# EAGLE schematic RP2040_MainV1_alternateLayout (EAGLE 9.6.2)

## Sheet 1 of 3
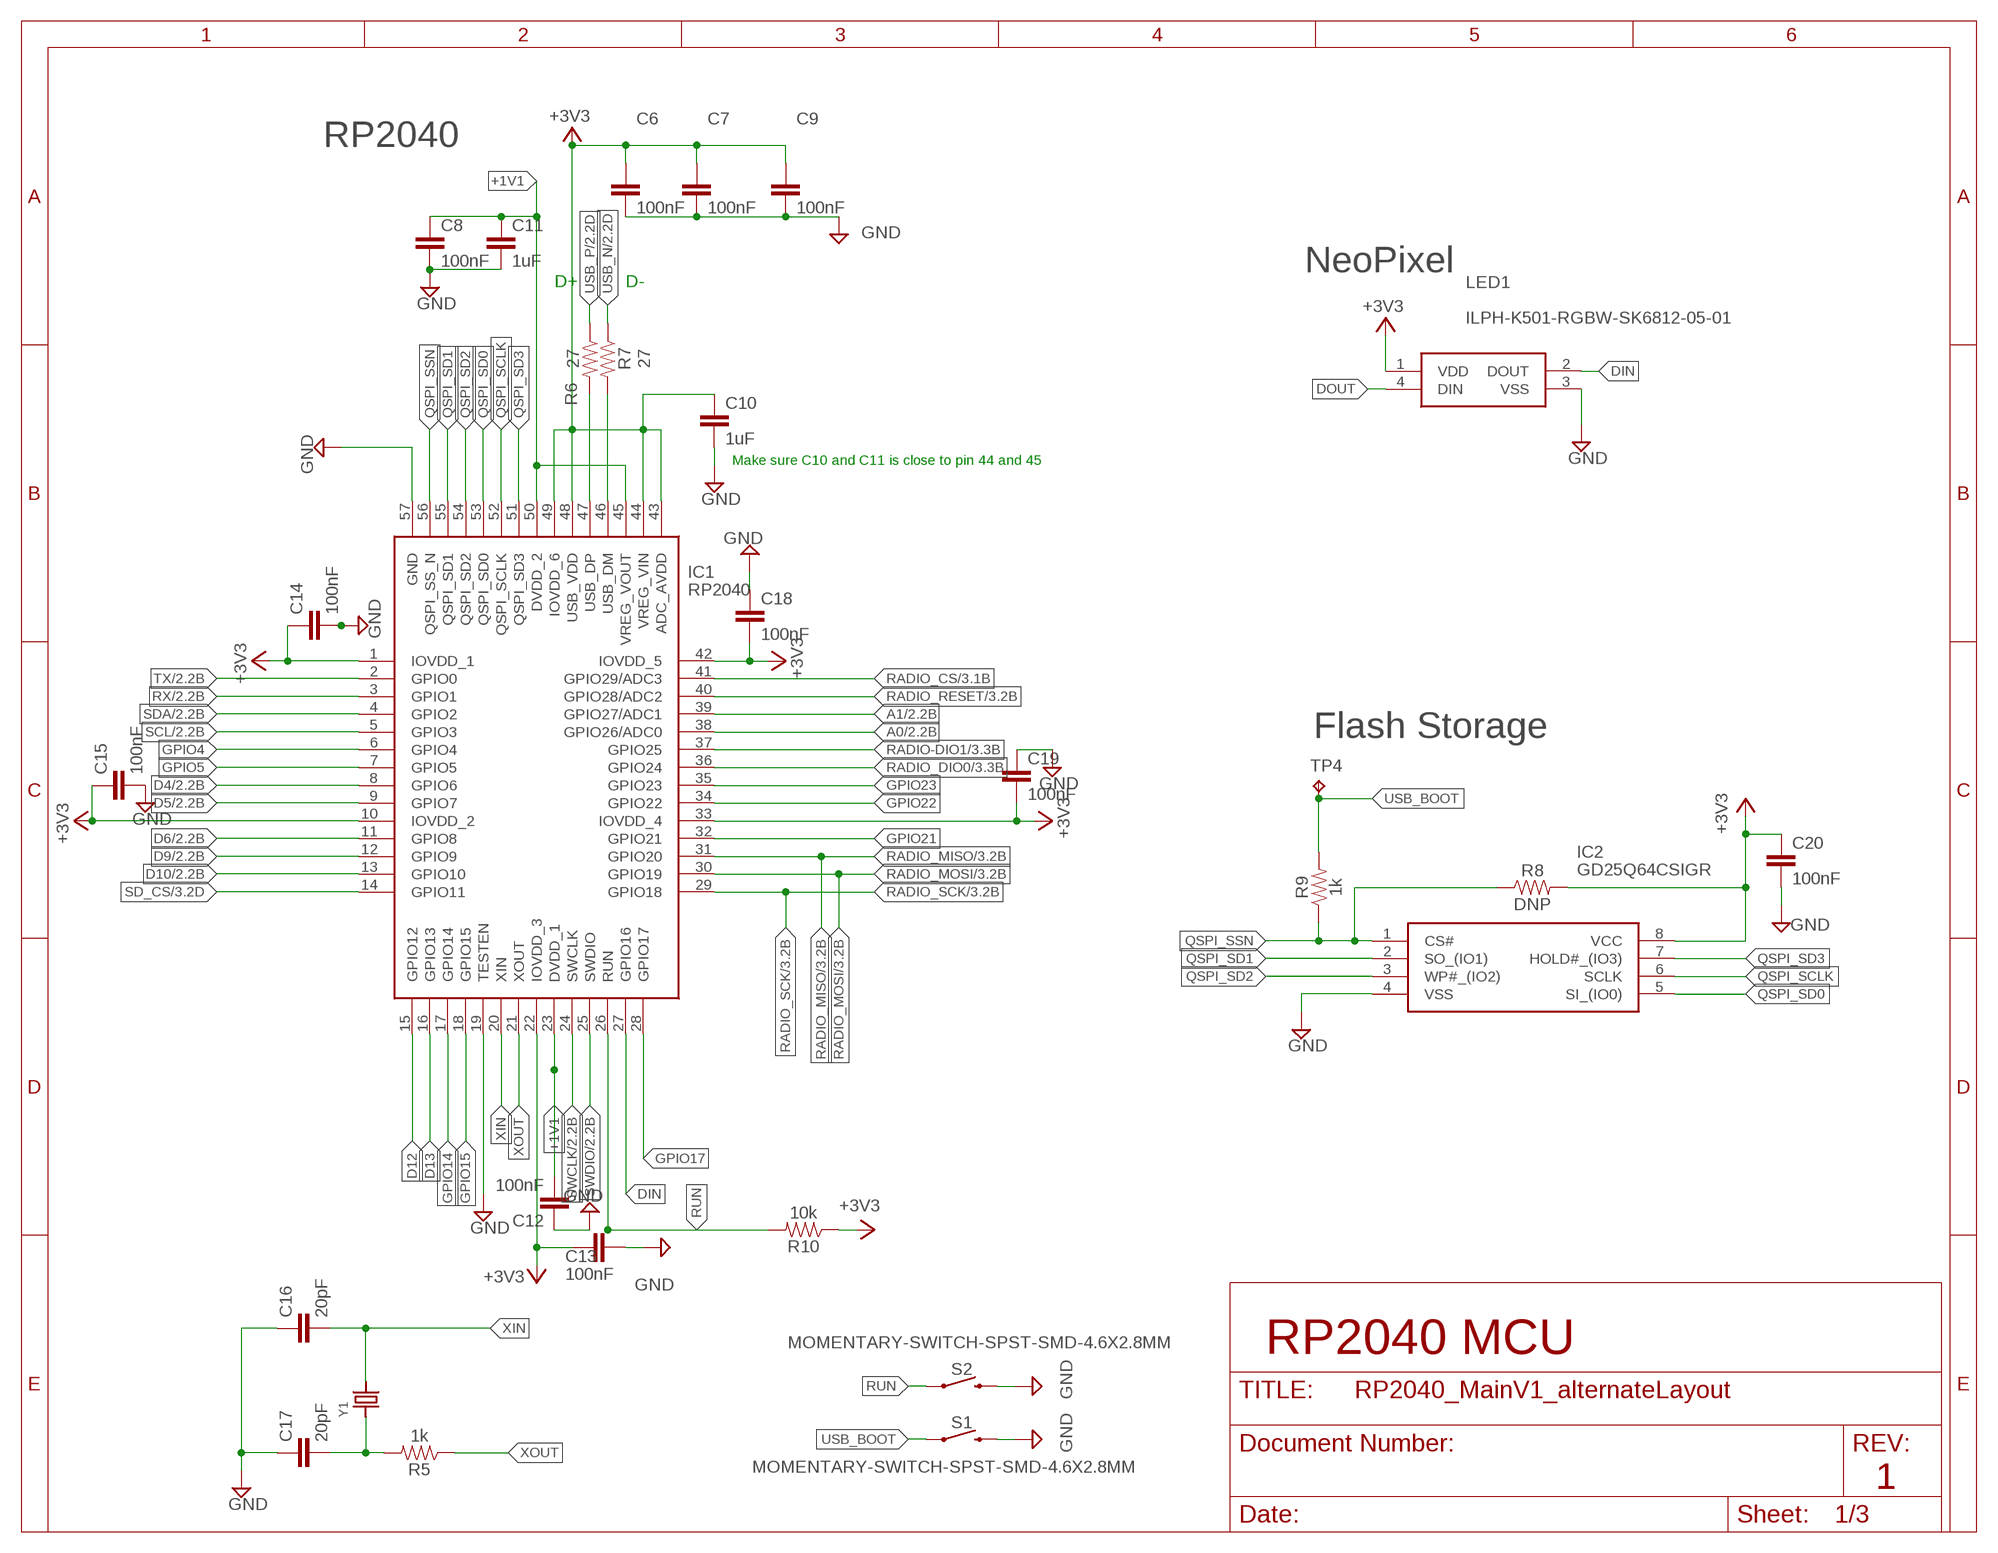
[diagram p0: schematic, sheet 1]

### Parts
C6  100nF  0.1UF-0402-10V-10%-X7R  [0402]
C7  100nF  0.1UF-0402-10V-10%-X7R  [0402]
C8  100nF  0.1UF-0402-10V-10%-X7R  [0402]
C9  100nF  0.1UF-0402-10V-10%-X7R  [0402]
C10  1uF  0.1UF-0402-10V-10%-X7R  [0402]
C11  1uF  0.1UF-0402-10V-10%-X7R  [0402]
C12  100nF  0.1UF-0402-10V-10%-X7R  [0402]
C13  100nF  0.1UF-0402-10V-10%-X7R  [0402]
C14  100nF  0.1UF-0402-10V-10%-X7R  [0402]
C15  100nF  0.1UF-0402-10V-10%-X7R  [0402]
C16  20pF  10NF-0603-50V-10%  [0603]
C17  20pF  10NF-0603-50V-10%  [0603]
C18  100nF  0.1UF-0402-10V-10%-X7R  [0402]
C19  100nF  0.1UF-0402-10V-10%-X7R  [0402]
C20  100nF  0.1UF-0603-25V-(+80/-20%)  [0603]
IC1  RP2040  [QFN40P700X700X90-57N]
IC2  GD25Q64CSIGR  [SOIC127P790X216-8N]
LED1  ILPH-K501-RGBW-SK6812-05-01  [ILPHK501RGBWSK68120501]
R5  1k  0.05OHM-0603-1/5W-1%  [0603]
R6  27  0.05OHM-0603-1/5W-1%  [0603]
R7  27  0.05OHM-0603-1/5W-1%  [0603]
R8  DNP  0.05OHM-0603-1/5W-1%  [0603]
R9  1k  0.05OHM-0603-1/5W-1%  [0603]
R10  10k  0.05OHM-0603-1/5W-1%  [0603]
S1  MOMENTARY-SWITCH-SPST-SMD-4.6X2.8MM  [TACTILE_SWITCH_SMD_4.6X2.8MM]
S2  MOMENTARY-SWITCH-SPST-SMD-4.6X2.8MM  [TACTILE_SWITCH_SMD_4.6X2.8MM]
TP4  TPTP12R  [TP12R]
Y1  CRYSTAL2.5X2.0MM  [CRYSTAL_2.5X2]

### Nets
+1V1: C8.1 C11.1 C12.2 IC1.23(DVDD_1) IC1.45(VREG_VOUT) IC1.50(DVDD_2)
+3V3: C6.1 C7.1 C9.1 C10.1 C13.2 C14.1 C15.1 C18.2 C19.2 C20.1 IC1.1(IOVDD_1) IC1.10(IOVDD_2) IC1.22(IOVDD_3) IC1.33(IOVDD_4) IC1.42(IOVDD_5) IC1.43(ADC_AVDD) IC1.44(VREG_VIN) IC1.48(USB_VDD) IC1.49(IOVDD_6) IC2.8(VCC) LED1.1(VDD) R8.2 R10.1 ; also sheet 2,3
A0: IC1.38(GPIO26/ADC0) ; also sheet 2
A1: IC1.39(GPIO27/ADC1) ; also sheet 2
D4: IC1.8(GPIO6) ; also sheet 2
D5: IC1.9(GPIO7) ; also sheet 2
D6: IC1.11(GPIO8) ; also sheet 2
D9: IC1.12(GPIO9) ; also sheet 2
D10: IC1.13(GPIO10) ; also sheet 2
D12: IC1.15(GPIO12)
D13: IC1.16(GPIO13)
DIN: IC1.27(GPIO16) LED1.2(DOUT)
DOUT: LED1.4(DIN)
GND: C6.2 C7.2 C8.2 C9.2 C10.2 C11.2 C12.1 C13.1 C14.2 C15.2 C16.1 C17.1 C18.1 C19.1 C20.2 IC1.19(TESTEN) IC1.57(GND) IC2.4(VSS) LED1.3(VSS) S1.3 S1.4 S2.3 S2.4 ; also sheet 2,3
GPIO4: IC1.6(GPIO4)
GPIO5: IC1.7(GPIO5)
GPIO14: IC1.17(GPIO14)
GPIO15: IC1.18(GPIO15)
GPIO17: IC1.28(GPIO17)
GPIO21: IC1.32(GPIO21)
GPIO22: IC1.34(GPIO22)
GPIO23: IC1.35(GPIO23)
N$1: C17.2 R5.2 Y1.1
QSPI_SCLK: IC1.52(QSPI_SCLK) IC2.6(SCLK)
QSPI_SD0: IC1.53(QSPI_SD0) IC2.5(SI_(IO0))
QSPI_SD1: IC1.55(QSPI_SD1) IC2.2(SO_(IO1))
QSPI_SD2: IC1.54(QSPI_SD2) IC2.3(WP#_(IO2))
QSPI_SD3: IC1.51(QSPI_SD3) IC2.7(HOLD#_(IO3))
QSPI_SSN: IC1.56(QSPI_SS_N) IC2.1(CS#) R8.1 R9.1
RADIO-DIO1: IC1.37(GPIO25) ; also sheet 3
RADIO_CS: IC1.41(GPIO29/ADC3) ; also sheet 3
RADIO_DIO0: IC1.36(GPIO24) ; also sheet 3
RADIO_MISO: IC1.31(GPIO20) ; also sheet 3
RADIO_MOSI: IC1.30(GPIO19) ; also sheet 3
RADIO_RESET: IC1.40(GPIO28/ADC2) ; also sheet 3
RADIO_SCK: IC1.29(GPIO18) ; also sheet 3
RUN: IC1.26(RUN) R10.2 S2.1 S2.2
RX: IC1.3(GPIO1) ; also sheet 2
SCL: IC1.5(GPIO3) ; also sheet 2
SD_CS: IC1.14(GPIO11) ; also sheet 3
SDA: IC1.4(GPIO2) ; also sheet 2
SWCLK: IC1.24(SWCLK) ; also sheet 2
SWDIO: IC1.25(SWDIO) ; also sheet 2
TX: IC1.2(GPIO0) ; also sheet 2
USB_BOOT: R9.2 S1.1 S1.2 TP4.TP
USB_DM\: IC1.46(USB_DM) R7.2
USB_DP: IC1.47(USB_DP) R6.2
USB_N: R7.1 ; also sheet 2
USB_P: R6.1 ; also sheet 2
XIN: C16.2 IC1.20(XIN) Y1.3
XOUT: IC1.21(XOUT) R5.1

### Notes on the sheet
- RP2040
- NeoPixel
- D+ | D-
- Make sure C10 and C11 is close to pin 44 and 45
- Flash Storage
- RP2040 MCU
- 1

## Sheet 2 of 3
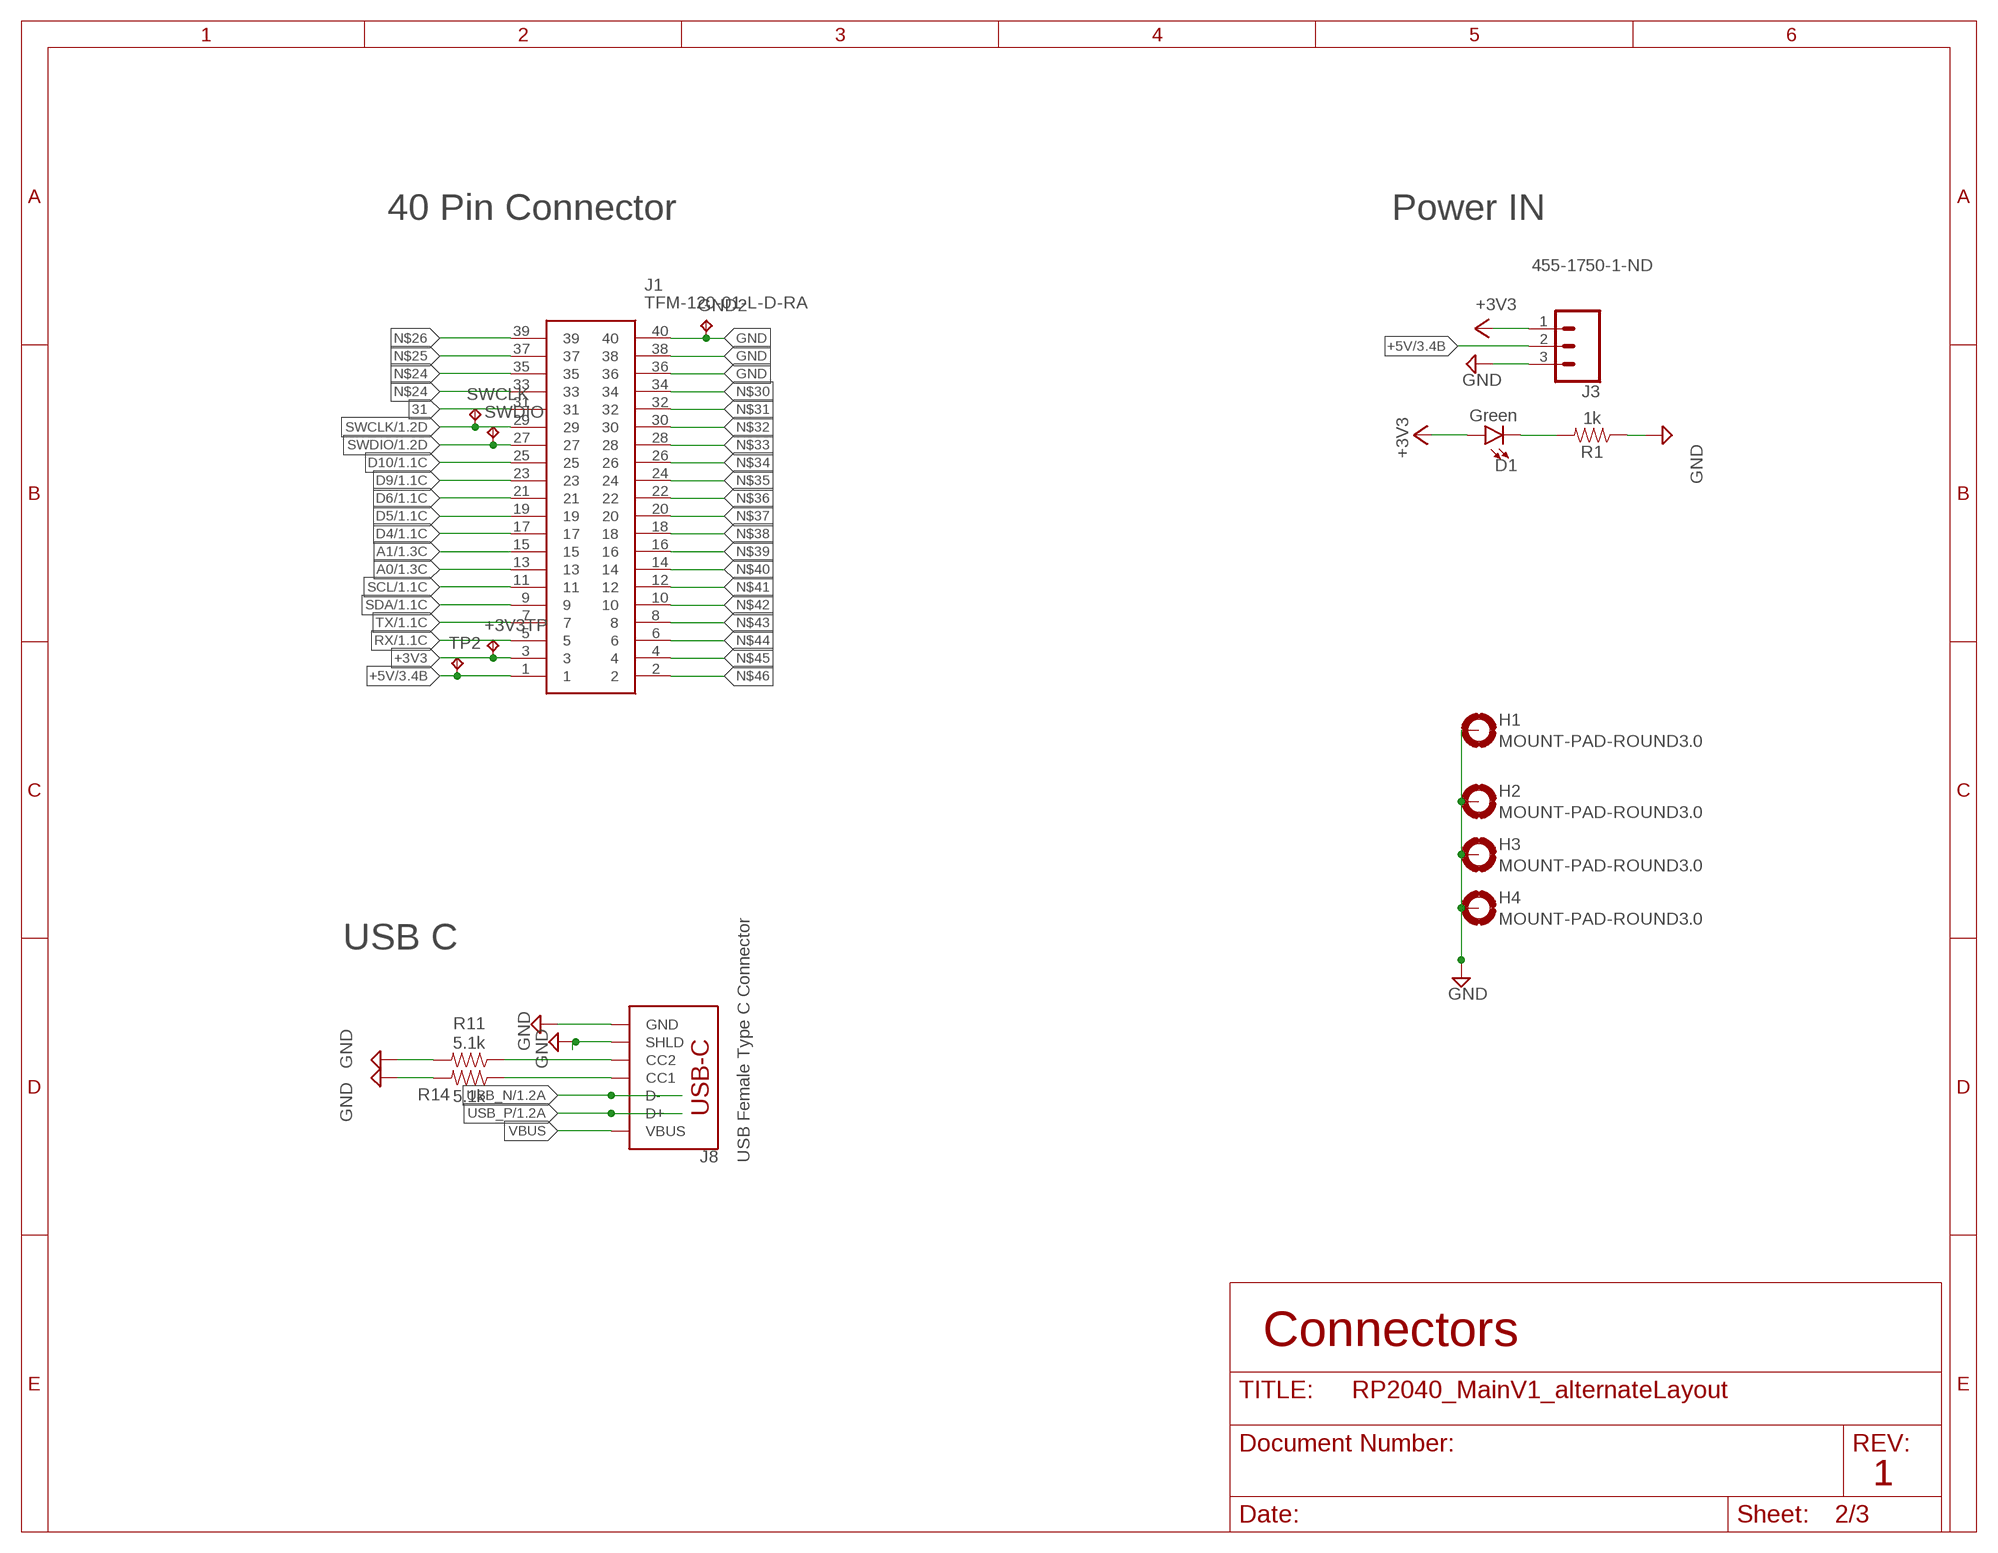
[diagram p1: schematic, sheet 2]

### Parts
+3V3TP  TPTP12R  [TP12R]
D1  Green  LED-GREEN-0603-WE  [LED-0603]
GND2  TPTP12R  [TP12R]
H1  MOUNT-PAD-ROUND3.0  [3,0-PAD]
H2  MOUNT-PAD-ROUND3.0  [3,0-PAD]
H3  MOUNT-PAD-ROUND3.0  [3,0-PAD]
H4  MOUNT-PAD-ROUND3.0  [3,0-PAD]
J1  TFM-120-01-L-D-RA  [TFM-120-01-XXX-D-RA]
J3  455-1750-1-ND  CONN_03  [1X03]
J8  USB Female Type C Connector  USB_C_4-LAYER-ISOLATED  [USB-C-16P-4LAYER-ISOLATED]
R1  1k  0.05OHM-0603-1/5W-1%  [0603]
R11  5.1k  0.05OHM-0603-1/5W-1%  [0603]
R14  5.1k  0.05OHM-0603-1/5W-1%  [0603]
SWCLK  TPTP12R  [TP12R]
SWDIO  TPTP12R  [TP12R]
TP2  TPTP12R  [TP12R]

### Nets
31: J1.31
+3V3: +3V3TP.TP D1.A J1.3 J3.1 ; also sheet 1,3
+5V: J1.1 J3.2 TP2.TP ; also sheet 3
A0: J1.13 ; also sheet 1
A1: J1.15 ; also sheet 1
D4: J1.17 ; also sheet 1
D5: J1.19 ; also sheet 1
D6: J1.21 ; also sheet 1
D9: J1.23 ; also sheet 1
D10: J1.25 ; also sheet 1
GND: GND2.TP H1.B3,0(MOUNT) H2.B3,0(MOUNT) H3.B3,0(MOUNT) H4.B3,0(MOUNT) J1.36 J1.38 J1.40 J3.3 J8.GND J8.GND2(GND) J8.SHLD1(SHLD) J8.SHLD2(SHLD) J8.SHLD3(SHLD) J8.SHLD4(SHLD) J8.SHLD5(SHLD) J8.SHLD6(SHLD) J8.SHLD7(SHLD) J8.SHLD8(SHLD) R1.1 R11.2 R14.2 ; also sheet 1,3
N$3: J8.B5(CC2) R11.1
N$4: J8.A5(CC1) R14.1
N$7: D1.C R1.2
N$23: J1.33
N$24: J1.35
N$25: J1.37
N$26: J1.39
N$30: J1.34
N$31: J1.32
N$32: J1.30
N$33: J1.28
N$34: J1.26
N$35: J1.24
N$36: J1.22
N$37: J1.20
N$38: J1.18
N$39: J1.16
N$40: J1.14
N$41: J1.12
N$42: J1.10
N$43: J1.8
N$44: J1.6
N$45: J1.4
N$46: J1.2
RX: J1.5 ; also sheet 1
SCL: J1.11 ; also sheet 1
SDA: J1.9 ; also sheet 1
SWCLK: J1.29 SWCLK.TP ; also sheet 1
SWDIO: J1.27 SWDIO.TP ; also sheet 1
TX: J1.7 ; also sheet 1
USB_N: J8.A7(D-) J8.B7(D-) ; also sheet 1
USB_P: J8.A6(D+) J8.B6(D+) ; also sheet 1
VBUS: J8.VBUS1(VBUS) J8.VBUS2(VBUS)

### Notes on the sheet
- 40 Pin Connector | Power IN
- USB C
- Connectors
- 1

## Sheet 3 of 3
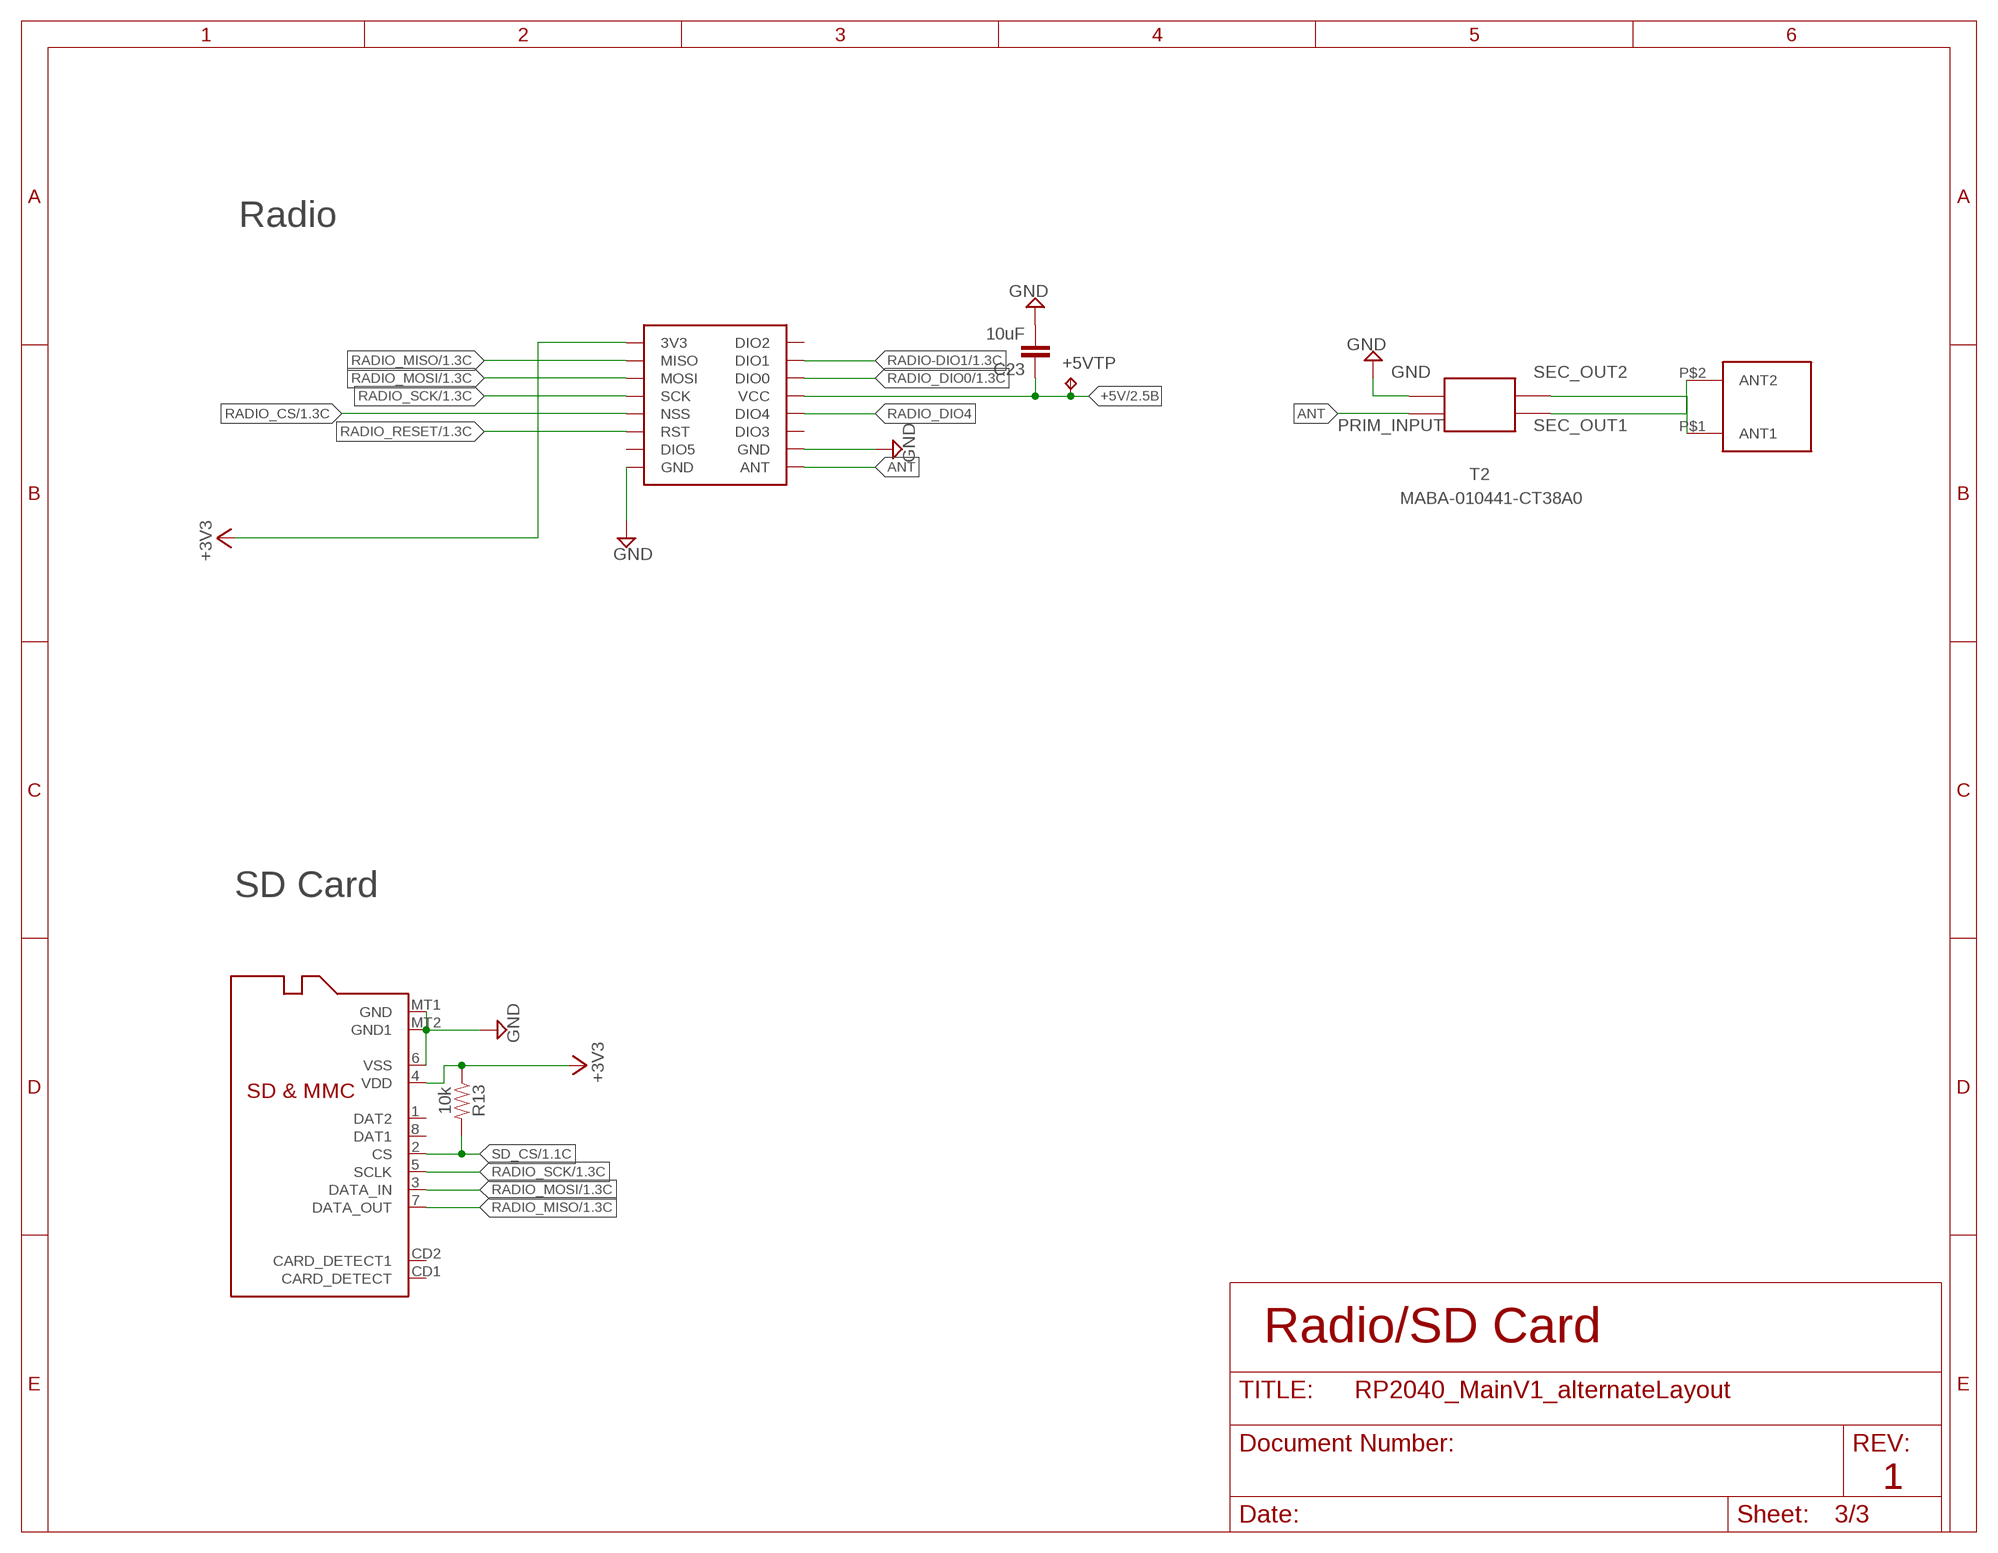
[diagram p2: schematic, sheet 3]

### Parts
+5VTP  TPTP12R  [TP12R]
C23  10uF  10UF-0603-6.3V-20%  [0603]
R13  10k  0.05OHM-0603-1/5W-1%  [0603]
T2  MABA-010441-CT38A0  [MABA010441CT38A0]
U$1  MICROSD  [MICROSD]
U$2  RFM95W  [RFM95PW]
U$4  BIGPAD  [BIGPADS]

### Nets
+3V3: R13.1 U$1.4(VDD) U$2.3V3 ; also sheet 1,2
+5V: +5VTP.TP C23.1 U$2.VCC ; also sheet 2
ANT: T2.1(PRIMARY_DOT_(INPUT)) U$2.ANT
GND: C23.2 T2.4(PRIMARY_(GROUND)) U$1.6(VSS) U$1.MT1(GND) U$1.MT2(GND1) U$2.GND@0(GND) U$2.GND@1(GND) ; also sheet 1,2
N$2: T2.2(SECONDARY_DOT_(OUTPUT_1)) U$4.P$2(ANT2)
N$5: T2.3(SECONDARY_(OUTPUT_2)) U$4.P$1(ANT1)
RADIO-DIO1: U$2.DIO1 ; also sheet 1
RADIO_CS: U$2.NSS ; also sheet 1
RADIO_DIO0: U$2.DIO0 ; also sheet 1
RADIO_DIO4: U$2.DIO4
RADIO_MISO: U$1.7(DATA_OUT) U$2.MISO ; also sheet 1
RADIO_MOSI: U$1.3(DATA_IN) U$2.MOSI ; also sheet 1
RADIO_RESET: U$2.RST ; also sheet 1
RADIO_SCK: U$1.5(SCLK) U$2.SCK ; also sheet 1
SD_CS: R13.2 U$1.2(CS) ; also sheet 1
Unconnected: U$1.1(DAT2) U$1.8(DAT1) U$1.CD1(CARD_DETECT) U$1.CD2(CARD_DETECT1) U$2.DIO2 U$2.DIO3 U$2.DIO5

### Notes on the sheet
- Radio
- SD Card
- Radio/SD Card
- 1

## Library data of the parts
+3V3TP +5VTP GND2 SWCLK SWDIO TP2 TP4 = testpad:TP: Test pad
C6-C15 C18 C19 = SparkFun-Capacitors:0.1UF: 0.1µF ceramic capacitors A capacitor is a passive two-terminal electrical component used to store electrical energy temporarily in an electric field.; PROD_ID: CAP-15083; VALUE: 0.1uF
C16 C17 = SparkFun-Capacitors:10NF: 0.01uF/10nF/10,000pF ceramic capacitors A capacitor is a passive two-terminal electrical component used to store electrical energy temporarily in an electric field. CAP-09321; PROD_ID: CAP-00867; VALUE: 10nF
C20 = SparkFun-Capacitors:0.1UF: 0.1µF ceramic capacitors A capacitor is a passive two-terminal electrical component used to store electrical energy temporarily in an electric field.; PROD_ID: CAP-00810; VALUE: 0.1uF
C23 = SparkFun-Capacitors:10UF: 10.0µF ceramic capacitors A capacitor is a passive two-terminal electrical component used to store electrical energy temporarily in an electric field.; PROD_ID: CAP-11015
D1 = SparkFun-LED:LED-GREEN: Green SMD LED Used in manufacturing of various products at SparkFun Packages: 0603 - SMD 0603 package [Product Link] <http://www.futureelectronics.com/en/technologies/semiconductors/optoelectronics/leds/Pages/9894312-LTST-C190GKT.aspx?CrossPart=HSMG-C190&IM=0> LilyPad 1206 - SMD1206 LilyPad package [Product Link] <http://www.futureelectronics.com/en/Technologies/Product.aspx?ProductID=IN150NGHARVATEKCORPORATION2049943&IM=0> 1206 - SMD1206 package [Product Link] <http://www.futureelectronics.com/en/technologies/semiconductors/optoelectronics/leds/Pages/8315665-LTST-C150KGKT.aspx?IM=0> 1206 Bottom Mount -SMD 1206 Bottom Mount [Product Link] <http://www.digikey.com/product-detail/en/lite-on-inc/LTST-C230KGKT/160-1456-1-ND/386854> SparkFun Products: Pro Mini 328 -5V <https://www.sparkfun.com/products/821> RedBoard <https://www.sparkfun.com/products/12757> MP3 Trigger <https://www.sparkfun.com/products/13720> Makey Makey <https://www.sparkfun.com/products/11076>; PROD_ID: DIO-16512
H1-H4 = holes:MOUNT-PAD-ROUND: MOUNTING PAD, round
IC1 = RP2040:RP2040: Microcontroller in QFN Package Source: Datasheet <https://datasheets.raspberrypi.org/rp2040/rp2040-datasheet.pdf>; DESCRIPTION: Microcontroller in QFN Package; HEIGHT: 0.9mm; MANUFACTURER_NAME: RASPBERRY-PI; MANUFACTURER_PART_NUMBER: RP2040
IC2 = GD25Q64CSIGR:GD25Q64CSIGR: NOR Flash 64Mbit NOR Flash /3.3V /SOP8 208mil /Industrial(-40? to +85?) /T&R Source: Datasheet <https://www.gigadevice.com/datasheet/gd25q64c/>; DESCRIPTION: NOR Flash 64Mbit NOR Flash /3.3V /SOP8 208mil /Industrial(-40? to +85?) /T&R; HEIGHT: 2.16mm; MANUFACTURER_NAME: GigaDevice; MANUFACTURER_PART_NUMBER: GD25Q64CSIGR; MOUSER_PART_NUMBER: 363-GD25Q64CSIGR; MOUSER_PRICE-STOCK: https://www.mouser.co.uk/ProductDetail/GigaDevice/GD25Q64CSIGR?qs=RcG8xmE7yp10Jy7JYr5cRA%3D%3D
J1 = TFM-120-01-L-D-RA:TFM-120-01-L-D-RA: 40 Position, High-Reliability Tiger Eye™ Terminal Strips, .050" Pitch, Right Angle Source: Datasheet <http://suddendocs.samtec.com/prints/tfm-1xx-xx-xxx-d-xxx-mkt.pdf>; ARROW_PART_NUMBER: TFM-120-01-L-D-RA; ARROW_PRICE-STOCK: https://www.arrow.com/en/products/tfm-120-01-l-d-ra/samtec; DESCRIPTION: 40 Position, High-Reliability Tiger Eye&trade; Terminal Strips, .050&quot; Pitch, Right Angle; HEIGHT: mm; MANUFACTURER_NAME: SAMTEC; MANUFACTURER_PART_NUMBER: TFM-120-01-L-D-RA; MOUSER_PART_NUMBER: 200-TFM12001LDRA; MOUSER_PRICE-STOCK: https://www.mouser.co.uk/ProductDetail/Samtec/TFM-120-01-L-D-RA?qs=Cqqh%252BS766wlg5fYnQYSkEA%3D%3D
J3 = SparkFun-Connectors:CONN_03: Multi connection point. Often used as Generic Header-pin footprint for 0.1 inch spaced/style header connections On any of the 0.1 inch spaced packages, you can populate with these: Break Away Headers - Straight <https://www.sparkfun.com/products/116> (PRT-00116) Break Away Male Headers - Right Angle <https://www.sparkfun.com/products/553> (PRT-00553) Female Headers <https://www.sparkfun.com/products/115> (PRT-00115) Break Away Headers - Machine Pin <https://www.sparkfun.com/products/117> (PRT-00117) Break Away Female Headers - Swiss Machine Pin <https://www.sparkfun.com/products/743> (PRT-00743) Stackable Header - 3 Pin (Female, 0.1") <https://www.sparkfun.com/products/13875> (PRT-13875) For SCREWTERMINALS and SPRING TERMINALS visit here: Screw Terimnals on SparkFun.com <https://www.sparkfun.com/search/results?term=Screw+Terminals> (5mm/3.5mm/2.54mm spacing) This device is also useful as a general connection point to wire up your design to another part of your project. Our various solder wires solder well into these plated through hole pads. Hook-Up Wire - Assortment (Stranded, 22 AWG) <https://www.sparkfun.com/products/11375> (PRT-11375) Hook-Up Wire - Assortment (Solid Core, 22 AWG) <https://www.sparkfun.com/products/11367> (PRT-11367) View the entire wire category on our website here <https://www.sparkfun.com/categories/141> Special notes: Molex polarized connector foot print use with SKU : PRT-08232 with associated crimp pins and housings.; PROD_ID: XXX-00000
J8 = SparkFun-Connectors:USB_C: USB Type C 16Pin Connector Super Speed pins not available on the 16-pin purely SMD connector so this part is best for USB 2.0 implementations. D1 and D2 are tied together enabling D+/- no matter which way the cable is plugged into the connector. The two channel configuration pins (CC1/2) are exposed. These are normally connected to ground via 5.1k resistors but can be reconfigured for high current/high power applications. **4-LAYER BOARD WARNING!!** If designing 4-layer board, make sure to select the variant _4-LAYER-ISOLATED. The linked footprint (USB-C-16-4LAYER-ISOLATED) includes some very necessary cutout polygons in the inner layers (2 and 15). This prevents the PTH mounting shield legs on the USB connector from electrically connecting any other polygons on the inner layers (usually VCC and GND).; PROD_ID: CONN-14122
LED1 = ILPH-K501-RGBW-SK6812-05-01:ILPH-K501-RGBW-SK6812-05-01: Pack of 10 RGBW 5050 LED 10mm PCB Star, PK Source: Datasheet <http://uk.rs-online.com/web/p/products/1921700>; DESCRIPTION: Pack of 10 RGBW 5050 LED 10mm PCB Star, PK; HEIGHT: 1.7mm; MANUFACTURER_NAME: Intelligent LED Solutions; MANUFACTURER_PART_NUMBER: ILPH-K501-RGBW-SK6812-05-01
R1 R5-R11 R13 R14 = SparkFun-Resistors:0.05OHM: 0.05Ω resistor A resistor is a passive two-terminal electrical component that implements electrical resistance as a circuit element. Resistors act to reduce current flow, and, at the same time, act to lower voltage levels within circuits. - Wikipedia; PROD_ID: RES-12535; VALUE: 0.05
S1 S2 = SparkFun-Switches:MOMENTARY-SWITCH-SPST: Momentary Switch (Pushbutton) - SPST Normally-open (NO) SPST momentary switches (buttons, pushbuttons). Variants PTH-12MM - 12mm square, through-hole Momentary Pushbutton Switch - 12mm Square <https://www.sparkfun.com/products/9190> (COM-09190) PTH-6.0MM, PTH-6.0MM-KIT - 6.0mm square, through-hole Mini Pushbutton Switch <https://www.sparkfun.com/products/97> (COM-00097) KIT package intended for soldering kit's - only one side of pads' copper is exposed. PTH-RIGHT-ANGLE-KIT - Right-angle, through-hole Right Angle Tactile Button <https://www.sparkfun.com/products/10791> - Used on SparkFun BigTime Watch Kit <https://www.sparkfun.com/products/11734> SMD-12MM - 12mm square, surface-mount Tactile Button - SMD (12mm) <https://www.sparkfun.com/products/12993> (COM-12993) Used on SparkFun PicoBoard <https://www.sparkfun.com/products/11888> SMD-4.5MM - 4.5mm Square Trackball Switch Used on SparkFun Blackberry Trackballer Breakout <https://www.sparkfun.com/products/13169> SMD-4.6MMX2.8MM - 4.60mm x 2.80mm, surface mount Used on SparkFun Pro Micro - RP2040 <https://www.sparkfun.com/products/17717> SMD-5.2MM, SMD-5.2-REDUNDANT - 5.2mm square, surface-mount Mini Pushbutton Switch - SMD <https://www.sparkfun.com/products/8720> (COM-08720) Used on Arduino Pro Mini <https://www.sparkfun.com/products/11114> REDUNDANT package connects both switch circuits together SMD-6.0X3.5MM - 6.0 x 3.5mm, surface mount Momentary Reset Switch SMD <https://www.sparkfun.com/products/8229> (COM-08229) SMD-6.2MM-TALL - 6.2mm square, surface mount Tactile Button - SMD (6mm) <https://www.sparkfun.com/products/12992> Used on SparkFun Digital Sandbox <https://www.sparkfun.com/products/12651> SMD-RIGHT-ANGLE - Right-angle, surface mount Used on SparkFun Block for Intel® Edison - Arduino <https://www.sparkfun.com/products/13036>; PROD_ID: SWCH-15606
T2 = MABA-010441-CT38A0:MABA-010441-CT38A0: Audio Transformers / Signal Transformers 5-1200MHz 1:3 Imped. 50 or 75 Ohm Source: Datasheet <https://datasheet.datasheetarchive.com/originals/distributors/Datasheets_SAMA/491663aa646f477f1fde48bf47218e07.pdf>; DESCRIPTION: Audio Transformers / Signal Transformers 5-1200MHz 1:3 Imped. 50 or 75 Ohm; HEIGHT: 3.43mm; MANUFACTURER_NAME: MACOM; MANUFACTURER_PART_NUMBER: MABA-010441-CT38A0; MOUSER_PART_NUMBER: 937-MABA10441-CT38A0; MOUSER_PRICE-STOCK: https://www.mouser.co.uk/ProductDetail/MACOM/MABA-010441-CT38A0?qs=uBHE7zYsG8UajKCSi2fvlA%3D%3D
U$1 = adafruit:MICROSD: Micro-SD / Transflash card holder with SPI pinout For the 3M # 2908-05WB-MG and/or 4UCON #19656 push-push type
U$2 = rfm:RFM95W
U$4 = bigpad - Copy:BIGPAD
Y1 = microbuilder:CRYSTAL: Crystals HC49UP - Surface Mount Crystal 4.0MHz 18pF +/-30ppm Surface Mount Crystal [Digikey: 535-9857-1-ND] 12.0 MHz Surface Mount Crystal [Digikey: 535-9869-6-ND] 25.0 MHz Surface Mount Crystal [Digikey: 535-9078-1-ND] 2.5 x 2.0mm - MEMs SMT Crystal 16.0 MHz 10pF 20ppm 2.5 x 2.0mm Crystal [Digikey -40-85°C: 535-10923-1-ND] 3.2 x 2.5mm - MEMs SMT Crystal 12.0 MHz 8pF 15ppm 3.2 x 2.5mm Crystal [Digikey: -10-70°C: 644-1047-1-ND -40-125°C: 644-1128-1-ND] 16.0 MHz 8pF 15ppm 3.2 x 2.5mm Crystal [Digikey: -10-70°C: 644-1049-1-ND -40-125°C: 644-1129-2-ND] 16.0 MHz 10pF 10ppm 3.2 x 2.5mm Crystal [Digikey: 644-1100-1-ND] 27.12 MHz 18pF 30ppm 3.2 x 2.5mm Crystal [Digikey: 887-1424-1-ND] 27.12MHz 10pF 10ppm 3.2 x 2.5mm Crystal [Digikey: 887-1329-1-ND] 4.9 x 1.8mm - MEMs SMT Crystal 32.768 KHz 12.5pF 20ppm 4.9 x 1.8mm Crystal [Digikey: SE2415CT-ND] 8.0 x 3.8mm - Surface Mount Crystal 32.768kHz 12.5pF 20ppm -40°C-85°C [Digikey: 535-9166-2-ND] Cylinder 32.768KHz Cylinder Crystal (2x6mm body) [Ex. Digikey: 300-8341-2-ND]